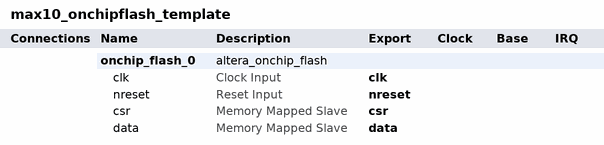
[diagram p0: system contents]
# Platform Designer (Qsys) system max10_onchipflash_template, MAX 10 10M16SAU169I7G
# Parameters at their usual value, and those the tool derives, are not listed.
package require -exact qsys 23.1
create_system max10_onchipflash_template
set_project_property DEVICE_FAMILY {MAX 10}
set_project_property DEVICE 10M16SAU169I7G

add_instance onchip_flash_0 altera_onchip_flash 23.1
set_instance_property onchip_flash_0 AUTO_EXPORT true
set_instance_parameter_value onchip_flash_0 CLOCK_FREQUENCY 80.0
set_instance_parameter_value onchip_flash_0 CONFIGURATION_MODE {Dual Compressed Images}
set_instance_parameter_value onchip_flash_0 SECTOR_ACCESS_MODE {Read and write,Read and write,Read and write,Read and write,Read and write}
set_instance_parameter_value onchip_flash_0 initFlashContent INITFLASHCONTENT
set_instance_parameter_value onchip_flash_0 initializationFileName UFM_HEX
set_instance_parameter_value onchip_flash_0 useNonDefaultInitFile USENONDEFAULTINITFILE

# exported interfaces
add_interface clk clock sink
set_interface_property clk EXPORT_OF onchip_flash_0.clk
add_interface csr avalon slave
set_interface_property csr EXPORT_OF onchip_flash_0.csr
add_interface data avalon slave
set_interface_property data EXPORT_OF onchip_flash_0.data
add_interface nreset reset sink
set_interface_property nreset EXPORT_OF onchip_flash_0.nreset

set_interconnect_requirement {$system} qsys_mm.clockCrossingAdapter HANDSHAKE
set_interconnect_requirement {$system} qsys_mm.enableEccProtection FALSE
set_interconnect_requirement {$system} qsys_mm.insertDefaultSlave FALSE
set_interconnect_requirement {$system} qsys_mm.maxAdditionalLatency 1

save_system max10_onchipflash_template.qsys
